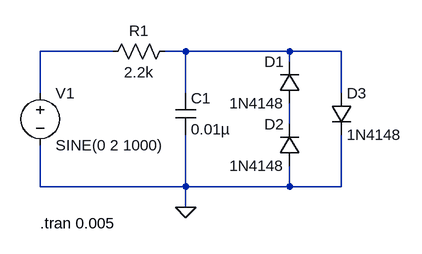
[diagram p0: schematic asym_diode_clipper.asc]
asym_diode_clipper.asc, the LTspice schematic file:
Version 4
SHEET 1 880 680
WIRE 128 80 16 80
WIRE 240 80 208 80
WIRE 400 80 240 80
WIRE 480 80 400 80
WIRE 400 96 400 80
WIRE 16 144 16 80
WIRE 240 144 240 80
WIRE 480 144 480 80
WIRE 400 192 400 160
WIRE 16 288 16 224
WIRE 240 288 240 208
WIRE 240 288 16 288
WIRE 400 288 400 256
WIRE 400 288 240 288
WIRE 480 288 480 208
WIRE 480 288 400 288
WIRE 240 320 240 288
FLAG 240 320 0
SYMBOL res 224 64 R90
WINDOW 0 0 56 VBottom 2
WINDOW 3 32 56 VTop 2
SYMATTR InstName R1
SYMATTR Value 2.2k
SYMBOL cap 224 144 R0
SYMATTR InstName C1
SYMATTR Value 0.01µ
SYMBOL voltage 16 128 R0
WINDOW 123 0 0 Left 2
WINDOW 39 0 0 Left 2
SYMATTR InstName V1
SYMATTR Value SINE(0 2 1000)
SYMBOL diode 416 160 R180
WINDOW 0 24 64 Left 2
WINDOW 3 24 0 Left 2
SYMATTR InstName D1
SYMATTR Value 1N4148
SYMBOL diode 416 256 R180
WINDOW 0 24 64 Left 2
WINDOW 3 24 0 Left 2
SYMATTR InstName D2
SYMATTR Value 1N4148
SYMBOL diode 464 144 R0
SYMATTR InstName D3
SYMATTR Value 1N4148
TEXT 16 344 Left 2 !.tran 0.005

The netlist it stands for:
* asym_diode_clipper.asc
R1 N002 N001 2.2k
C1 N002 0 0.01µ
V1 N001 0 SINE(0 2 1000)
D1 N003 N002 1N4148
D2 0 N003 1N4148
D3 N002 0 1N4148
.model D D
.lib standard.dio
.tran 0.005
.backanno
.end